# EAGLE design TI Bluetooth (EAGLE 9.6.2)
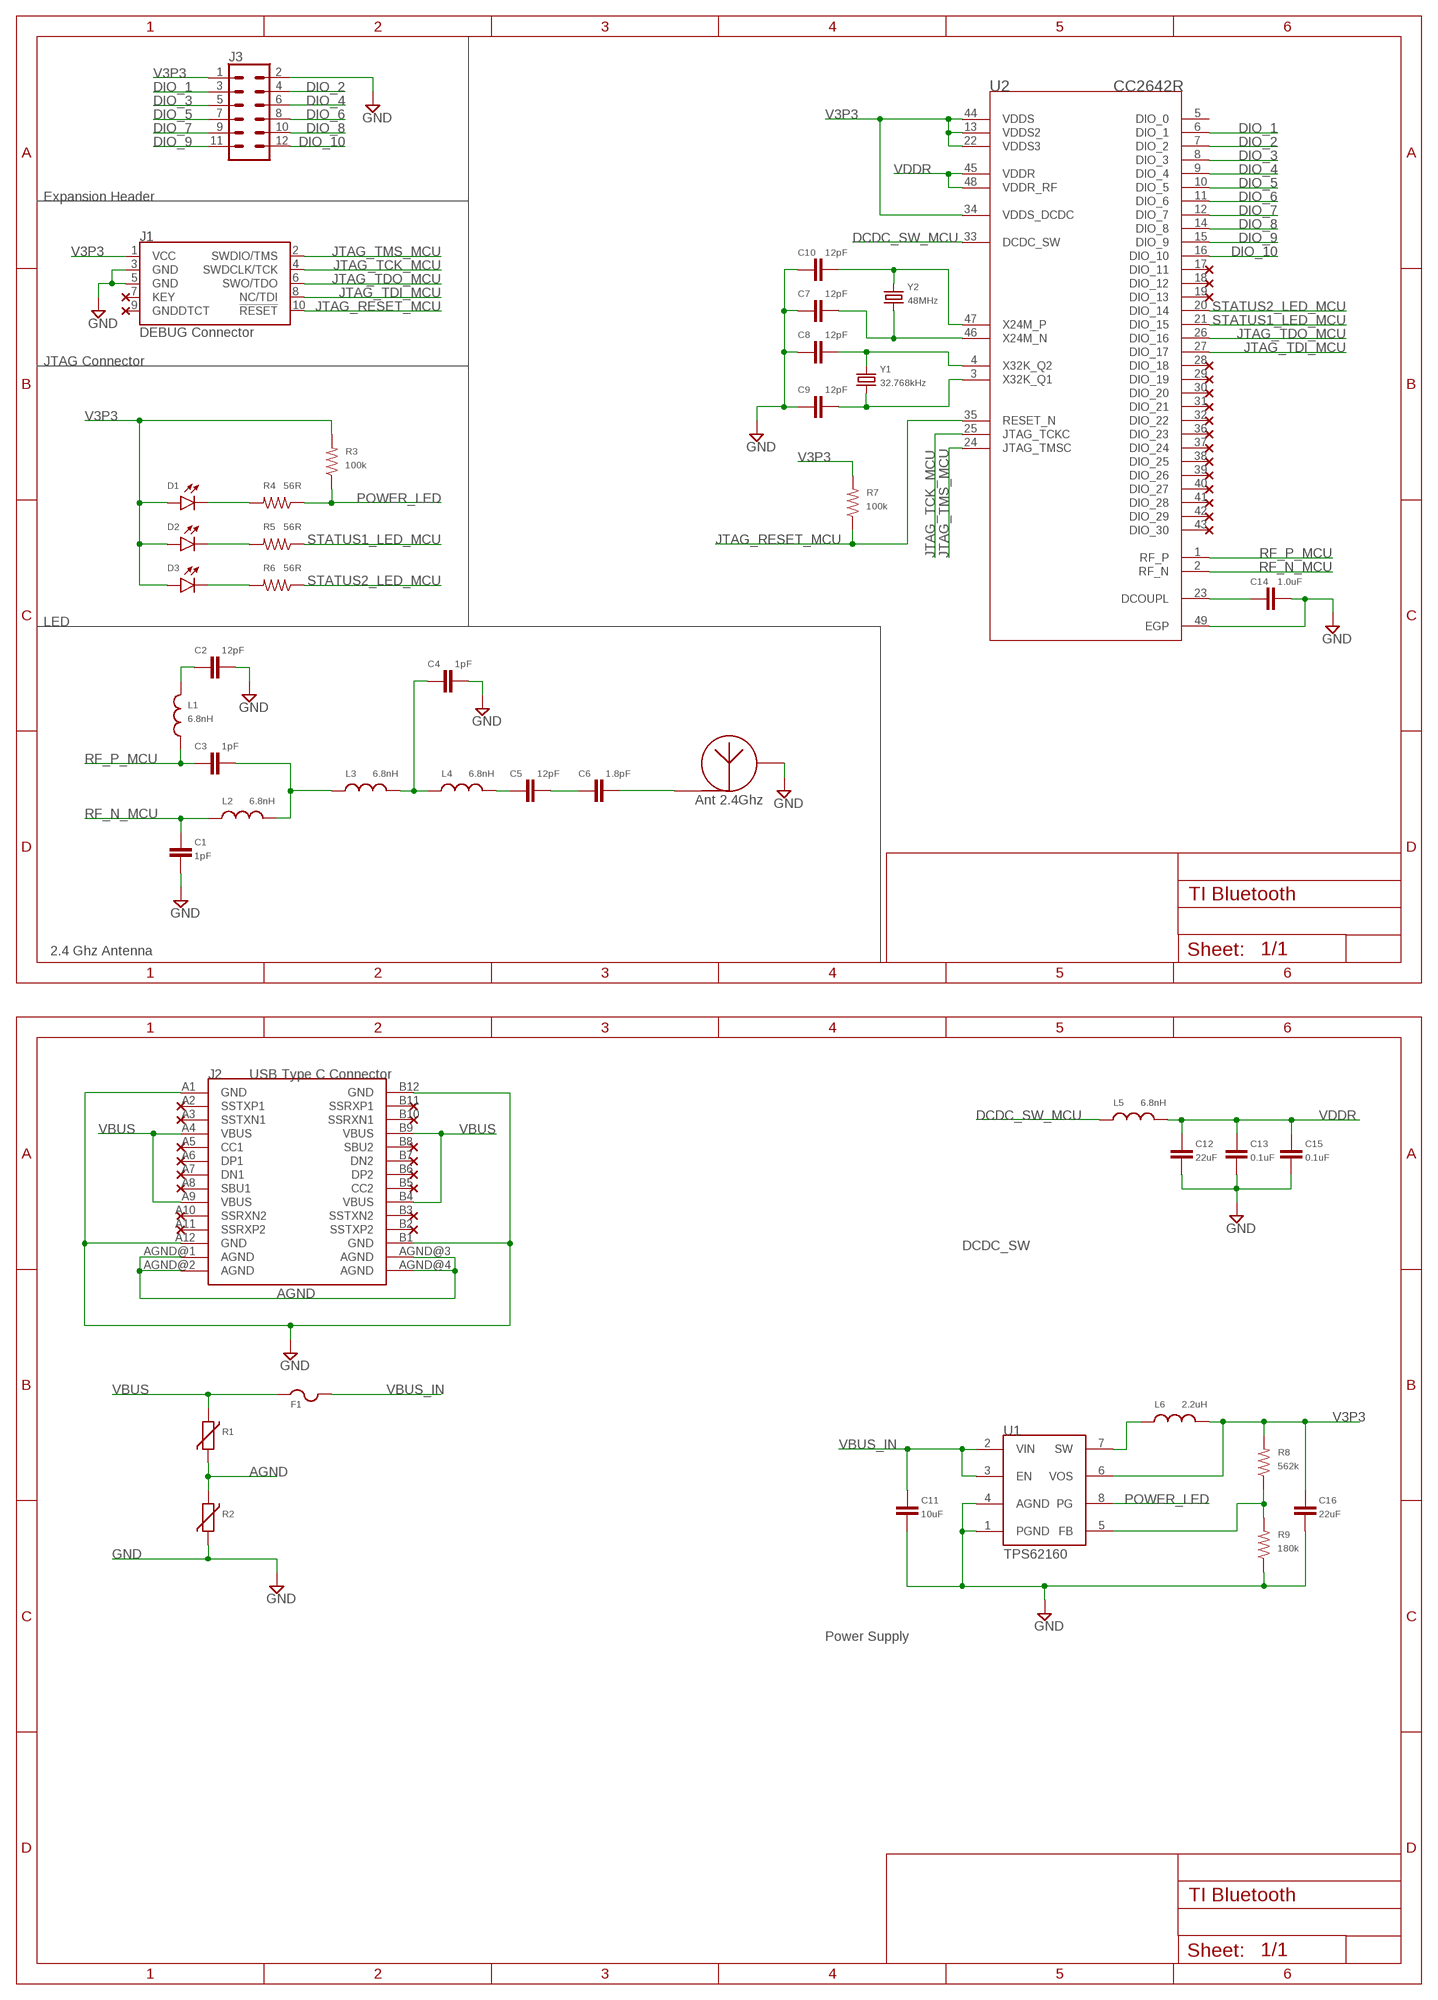
[diagram p0: schematic, sheet 1]

## Parts
ANT1  TI_AN043  [TI_AN043]
C1  1pF  C-EUC0603  [C0603]
C2  12pF  C-EUC0603  [C0603]
C3  1pF  C-EUC0603  [C0603]
C4  1pF  C-EUC0603  [C0603]
C5  12pF  C-EUC0603  [C0603]
C6  1.8pF  C-EUC0603  [C0603]
C7  12pF  C-EUC0603  [C0603]
C8  12pF  C-EUC0603  [C0603]
C9  12pF  C-EUC0603  [C0603]
C10  12pF  C-EUC0603  [C0603]
C11  10uF  C-EUC0603  [C0603]
C12  22uF  C-EUC0603  [C0603]
C13  0.1uF  C-EUC0603  [C0603]
C14  1.0uF  C-EUC0603  [C0603]
C15  0.1uF  C-EUC0603  [C0603]
C16  22uF  C-EUC0603  [C0603]
D1  POWER  LED1206  [LED-1206]
D2  STATUS1  LED1206  [LED-1206]
D3  STATUS2  LED1206  [LED-1206]
F1  1206L110THYR  PTCFUSE-1206  [R1206]
J1  DEBUG Connector  CORTEX_DEBUG_SMD  [SAMTECH_FTSH-105-01]
J2  USB Type C Connector  USB-C31-S-RA-CS1-BK-TR  [USB-C31-S-RA-CS1-BK-TR]
J3  Expansion Header  CONN_06X2PTH_FEMALE  [2X6]
L1  6.8nH  L_CHIP-0603(1608-METRIC)  [INDC1608X95N]
L2  6.8nH  L_CHIP-0603(1608-METRIC)  [INDC1608X95N]
L3  6.8nH  L_CHIP-0603(1608-METRIC)  [INDC1608X95N]
L4  6.8nH  L_CHIP-0603(1608-METRIC)  [INDC1608X95N]
L5  6.8nH  L_CHIP-0603(1608-METRIC)  [INDC1608X95N]
L6  2.2uH  L_CHIP-0603(1608-METRIC)  [INDC1608X95N]
R1  V5.5MLA  VARISTORCN0603  [CT/CN0603]
R2  V5.5MLA  VARISTORCN0603  [CT/CN0603]
R3  100k  R-US_R0603  [R0603]
R4  56R  R-US_R0603  [R0603]
R5  56R  R-US_R0603  [R0603]
R6  56R  R-US_R0603  [R0603]
R7  100k  R-US_R0603  [R0603]
R8  562k  R-US_R0603  [R0603]
R9  180k  R-US_R0603  [R0603]
U1  TPS62160  TPS62160VSSOP  [SOP65P490X110-8N]
U2  CC2642R  CC2642R1FRGZRRGZ0048A  [QFN50P700X690X100-49T515N]
Y1  32.768kHz  CRYSTAL-32.768KHZPTH-2X6  [CRYSTAL-PTH-2X6-CYL]
Y2  48MHz  CRYSTALSMD-5X3.2-2PAD  [CRYSTAL-SMD-5X3.2-2PAD]

## Nets
AGND: J2.AGND@1(AGND) J2.AGND@2(AGND) J2.AGND@3(AGND) J2.AGND@4(AGND) R1.2 R2.1
DCDC_SW_MCU: L5.1 U2.33(DCDC_SW)
DIO_1: J3.3 U2.6(DIO_1)
DIO_2: J3.4 U2.7(DIO_2)
DIO_3: J3.5 U2.8(DIO_3)
DIO_4: J3.6 U2.9(DIO_4)
DIO_5: J3.7 U2.10(DIO_5)
DIO_6: J3.8 U2.11(DIO_6)
DIO_7: J3.9 U2.12(DIO_7)
DIO_8: J3.10 U2.14(DIO_8)
DIO_9: J3.11 U2.15(DIO_9)
DIO_10: J3.12 U2.16(DIO_10)
GND: ANT1.FEED ANT1.RETURN C1.2 C2.2 C4.2 C6.2 C7.1 C8.1 C9.1 C10.2 C11.2 C12.2 C13.2 C14.2 C15.2 C16.2 J1.3(GND) J1.5(GND) J2.A1(GND) J2.A12(GND) J2.B1(GND) J2.B12(GND) J3.2 R2.2 R9.1 U1.1(PGND) U1.4(AGND) U2.49(EGP)
JTAG_RESET_MCU: J1.10(!RESET) R7.1 U2.35(RESET_N)
JTAG_TCK_MCU: J1.4(SWDCLK/TCK) U2.25(JTAG_TCKC)
JTAG_TDI_MCU: J1.8(NC/TDI) U2.27(DIO_17)
JTAG_TDO_MCU: J1.6(SWO/TDO) U2.26(DIO_16)
JTAG_TMS_MCU: J1.2(SWDIO/TMS) U2.24(JTAG_TMSC)
N$1: C8.2 U2.4(X32K_Q2) Y1.1
N$2: C9.2 U2.3(X32K_Q1) Y1.2
N$3: C10.1 U2.47(X24M_P) Y2.P$2
N$5: C14.1 U2.23(DCOUPL)
N$6: C2.1 L1.2
N$7: C7.2 U2.46(X24M_N) Y2.P$1
N$10: L6.1 U1.7(SW)
N$12: C4.1 L3.2 L4.1
N$13: C3.2 L2.2 L3.1
N$14: C5.1 L4.2
N$16: R8.1 R9.2 U1.5(FB)
N$17: C5.2 C6.1
N$18: D1.C R4.2
N$19: D3.C R6.2
N$20: D2.C R5.2
POWER_LED: R3.1 R4.1 U1.8(PG)
RF_N_MCU: C1.1 L2.1 U2.2(RF_N)
RF_P_MCU: C3.1 L1.1 U2.1(RF_P)
STATUS1_LED_MCU: R5.1 U2.21(DIO_15)
STATUS2_LED_MCU: R6.1 U2.20(DIO_14)
V3P3: C16.1 D1.A D2.A D3.A J1.1(VCC) J3.1 L6.2 R3.2 R7.2 R8.2 U1.6(VOS) U2.13(VDDS2) U2.22(VDDS3) U2.34(VDDS_DCDC) U2.44(VDDS)
VBUS: F1.1 J2.A4(VBUS) J2.A9(VBUS) J2.B4(VBUS) J2.B9(VBUS) R1.1
VBUS_IN: C11.1 F1.2 U1.2(VIN) U1.3(EN)
VDDR: C12.1 C13.1 C15.1 L5.2 U2.45(VDDR) U2.48(VDDR_RF)
Unconnected: J1.7(KEY) J1.9(GNDDTCT) J2.A2(SSTXP1) J2.A3(SSTXN1) J2.A5(CC1) J2.A6(DP1) J2.A7(DN1) J2.A8(SBU1) J2.A10(SSRXN2) J2.A11(SSRXP2) J2.B2(SSTXP2) J2.B3(SSTXN2) J2.B5(CC2) J2.B6(DP2) J2.B7(DN2) J2.B8(SBU2) J2.B10(SSRXN1) J2.B11(SSRXP1) U2.5(DIO_0) U2.17(DIO_11) U2.18(DIO_12) U2.19(DIO_13) U2.28(DIO_18) U2.29(DIO_19) U2.30(DIO_20) U2.31(DIO_21) U2.32(DIO_22) U2.36(DIO_23) U2.37(DIO_24) U2.38(DIO_25) U2.39(DIO_26) U2.40(DIO_27) U2.41(DIO_28) U2.42(DIO_29) U2.43(DIO_30)

## Notes on the sheet
- Expansion Header
- JTAG Connector
- LED
- 2.4 Ghz Antenna
- DCDC_SW
- Power Supply

## Library data of the parts
ANT1 = MyLibrary:TI_AN043: TI Antenna AN043 2.4GHz
C1-C16 = resistor:C-EU: CAPACITOR, European symbol
D1-D3 = SparkFun-LED:LED: LED (Generic) Standard schematic elements and footprints for 5mm, 3mm, 1206, and 0603 sized LEDs. Generic LEDs with no color specified.; PN: EAST1608GA6
F1 = adafruit:PTCFUSE: PTC fuses, resettable thermistors; PN: 1206L110THYR
J1 = SparkFun-Connectors:CORTEX_DEBUG: Cortex Debug Connector - 10 pin Supports JTAG debug, Serial Wire debug, and Serial Wire Viewer. PTH and SMD connector options available. General Connector Information <http://infocenter.arm.com/help/topic/com.arm.doc.faqs/attached/13634/cortex_debug_connectors.pdf> Products: PTH Connector <http://www.digikey.com/product-detail/en/cnc-tech/3220-10-0100-00/1175-1627-ND/3883661> -via Digi-Key SparkFun PSoc <https://www.sparkfun.com/products/13229> SparkFun T <https://www.sparkfun.com/products/13810>
J2 = MyLibrary:USB-C31-S-RA-CS1-BK-TR
J3 = SparkFun-Connectors:CONN_06X2: Multi connection point. Often used as Generic Header-pin footprint for 0.1 inch spaced/style header connections On any of the 0.1 inch spaced packages, you can populate with these: Break Away Headers - Straight <https://www.sparkfun.com/products/116> (PRT-00116) Break Away Male Headers - Right Angle <https://www.sparkfun.com/products/553> (PRT-00553) Female Headers <https://www.sparkfun.com/products/115> (PRT-00115) Break Away Headers - Machine Pin <https://www.sparkfun.com/products/117> (PRT-00117) Break Away Female Headers - Swiss Machine Pin <https://www.sparkfun.com/products/743> (PRT-00743); PROD_ID: CONN-12423; VALUE: 2X6 FEMALE
L1-L6 = Inductor:L: Inductor Fixed - Generic; CATEGORY: Inductor; SUB-CATEGORY: Fixed
R1 R2 = varistor:VARISTOR: VARISTOR; PN: V5.5MLA0603
R3-R9 = resistor:R-US_: RESISTOR, American symbol
U1 = MyLibrary:TPS62160; PN: TPS62160DGKR
U2 = MyLibrary:CC2642R1FRGZR: TI CC2642R MCU
Y1 = SparkFun-Clocks:CRYSTAL-32.768KHZ: 32.768kHz Crystal Frequency: 32.768kHz Frequency Stability: ±20ppm Load Capacitance: 12.5pF (PTH-2X6 & SMD-3.2X1.5), 6pF (SMD-2X6) SparkFun Products: SparkFun BigTime Watch Kit <https://www.sparkfun.com/products/11734> SparkFun nRF52832 Breakout <https://www.sparkfun.com/products/13990> SparkFun Real Time Clock Module <https://www.sparkfun.com/products/12708>; PN: AB26T; PROD_ID: XTAL-10112
Y2 = SparkFun-Clocks:CRYSTAL: Crystals (Generic) These are passive quartz crystals, which can be used as a clock source for a microcontroller. Crystal's are two-terminal devices. They require external "load" capacitors to generate an oscillating signal.

## Board
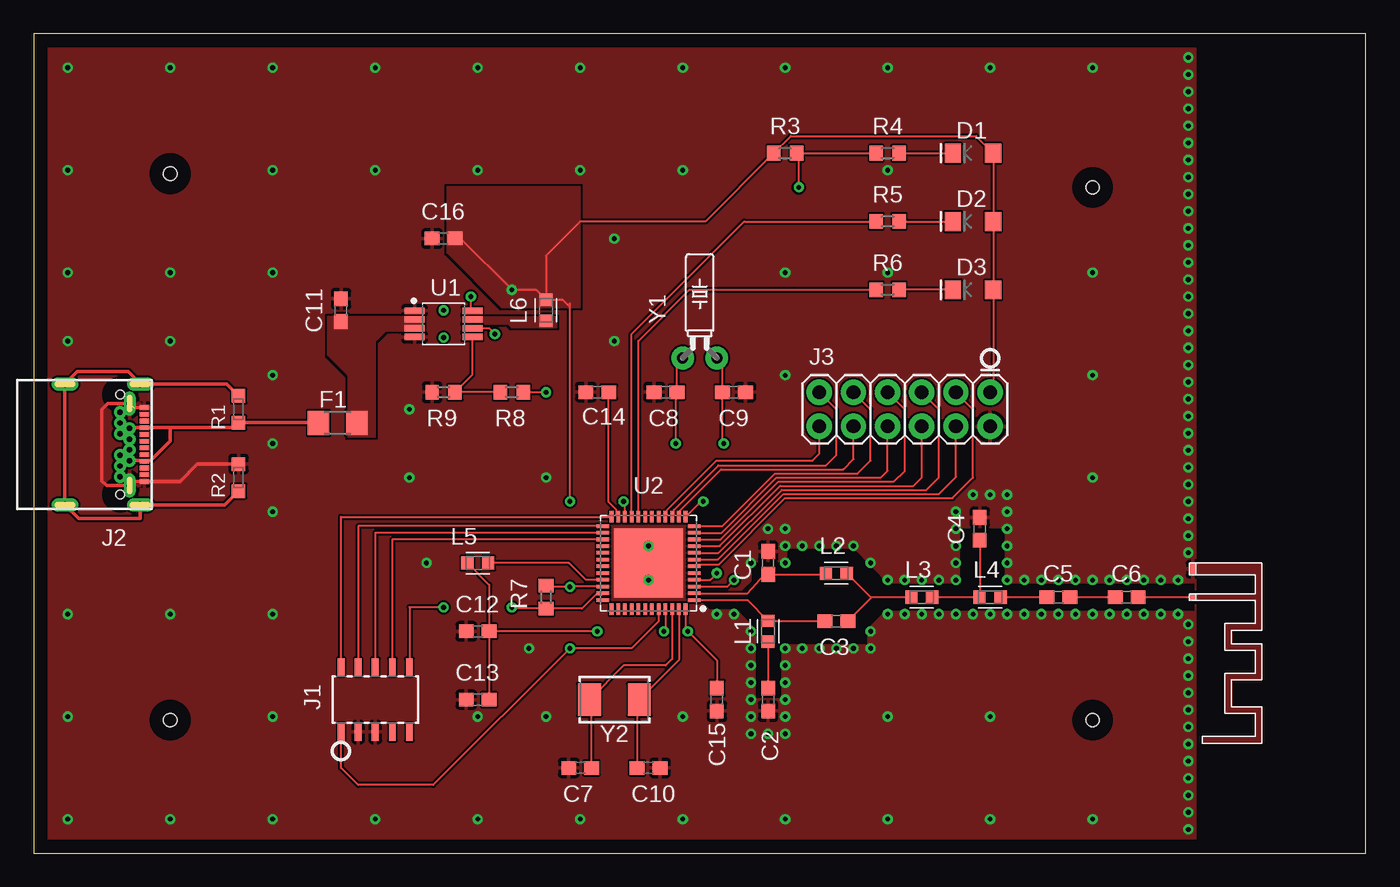
[diagram p1: board, top side]
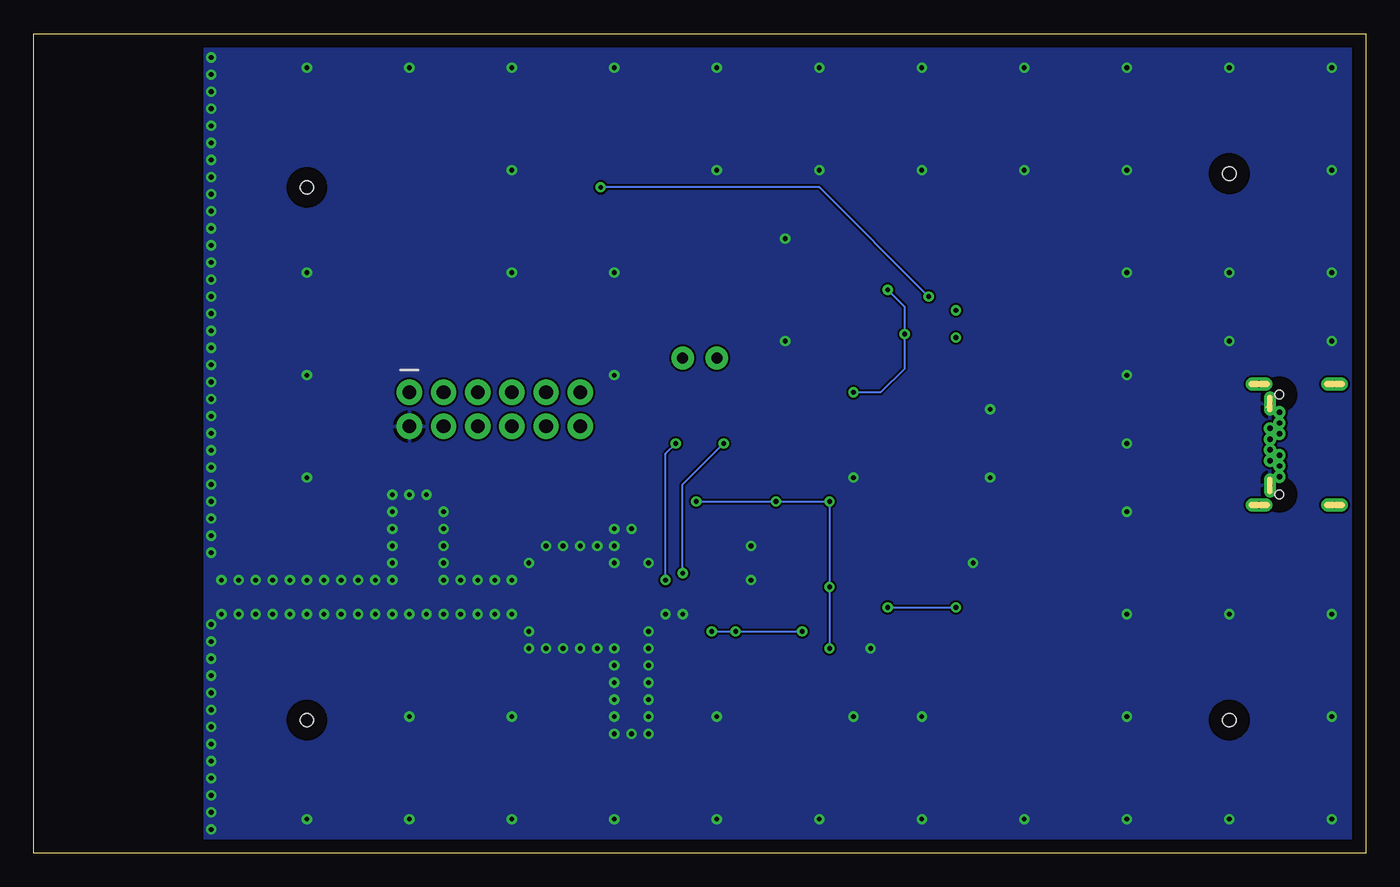
[diagram p2: board, bottom side, seen from below]

Size 99.06 x 60.96 mm. Coordinates in mm from the lower left corner, seen from the top.
Outline: 0,0 99.06,0 99.06,60.96 0,60.96 0,0
Copper layers (1*16): Top 0.035mm / dielectric 1.5mm / Bottom 0.035mm
Design rules "default": minimum track width 6mil, minimum drill 0.35mm, track to track 6mil, track to pad 6mil, pad to pad 6mil, via to via 6mil, smd to smd 6mil, copper to edge 40mil, drill to drill 6mil, minimum pad ring 10mil, minimum via ring 8mil, stop-mask expansion 4mil, vias tented up to drill 0mil, thermal gap 10mil
Holes 1 mm at 10.16,50.55 10.16,9.91 78.74,9.91 78.74,49.53

### Footprints (pad centres in the part's own frame; a part is rotated, then mirrored left to right if it is on the bottom)
TI_AN043 = smd 0.5 x 0.5: FEED 2.55,-0.25 | smd 0.9 x 0.5: RETURN 0.45,-0.25
C0603 = smd 1.1 x 1: 1 -0.85,0; 2 0.85,0
LED-1206 = smd 1.2 x 1.4: A -1.5,0; C 1.5,0
R1206 = smd 1.6 x 1.803: 1 -1.422,0; 2 1.422,0
SAMTECH_FTSH-105-01 = smd 0.508 x 1.27: 1 -2.54,-2.413; 2 -2.54,2.413; 3 -1.27,-2.413; 4 -1.27,2.413; 5 0,-2.413; 6 0,2.413; 7 1.27,-2.413; 8 1.27,2.413; 9 2.54,-2.413; 10 2.54,2.413
USB-C31-S-RA-CS1-BK-TR = smd 0.35 x 0.7: A1 7.75,0.65; A2 7.25,0.65; A3 6.75,0.65; A4 6.25,0.65; A5 5.75,0.65; A6 5.25,0.65; A7 4.75,0.65; A8 4.25,0.65; A9 3.75,0.65; A10 3.25,0.65; A11 2.75,0.65; A12 2.25,0.65 | drill 0.5 pad 1 long: AGND@1 9.5,0.96; AGND@2 9.5,6.56; AGND@3 0.5,0.96; AGND@4 0.5,6.56 | drill 0.4 pad 0.7 long: B1 1.95,1.76; B12 8.05,1.76 | drill 0.4 pad 0.61: B2 2.6,2.46; B3 3.4,2.46; B4 3.8,1.76; B5 4.2,2.46; B6 4.6,1.76; B7 5.4,1.76; B8 5.8,2.46; B9 6.2,1.76; B10 6.6,2.46; B11 7.4,2.46 | hole 0.65: 8.725,2.46; 1.275,2.46
2X6 = drill 1.016 pad 1.88: 1 0,0; 2 0,2.54; 3 2.54,0; 4 2.54,2.54; 5 5.08,0; 6 5.08,2.54; 7 7.62,0; 8 7.62,2.54; 9 10.16,0; 10 10.16,2.54; 11 12.7,0; 12 12.7,2.54
INDC1608X95N = smd 0.9 x 0.97: 1 -0.785,0 | smd 0.933 x 0.97: 2 0.769,0
CT/CN0603 = smd 1 x 1: 1 -1,0; 2 1,0
R0603 = smd 1 x 1.1: 1 -0.85,0; 2 0.85,0
SOP65P490X110-8N = smd 1.471 x 0.481: 1 -2.15,0.975; 2 -2.15,0.325; 3 -2.15,-0.325; 4 -2.15,-0.975; 5 2.15,-0.975; 6 2.15,-0.325; 7 2.15,0.325; 8 2.15,0.975
QFN50P700X690X100-49T515N = smd 0.936 x 0.264: 1 -3.389,2.75; 2 -3.389,2.25; 3 -3.389,1.75; 4 -3.389,1.25; 5 -3.389,0.75; 6 -3.389,0.25; 7 -3.389,-0.25; 8 -3.389,-0.75; 9 -3.389,-1.25; 10 -3.389,-1.75; 11 -3.389,-2.25; 12 -3.389,-2.75; 25 3.389,-2.75; 26 3.389,-2.25; 27 3.389,-1.75; 28 3.389,-1.25; 29 3.389,-0.75; 30 3.389,-0.25; 31 3.389,0.25; 32 3.389,0.75; 33 3.389,1.25; 34 3.389,1.75; 35 3.389,2.25; 36 3.389,2.75 | smd 0.264 x 0.86: 13 -2.75,-3.435; 14 -2.25,-3.435; 15 -1.75,-3.435; 16 -1.25,-3.435; 17 -0.75,-3.435; 18 -0.25,-3.435; 19 0.25,-3.435; 20 0.75,-3.435; 21 1.25,-3.435; 22 1.75,-3.435; 23 2.25,-3.435; 24 2.75,-3.435; 37 2.75,3.435; 38 2.25,3.435; 39 1.75,3.435; 40 1.25,3.435; 41 0.75,3.435; 42 0.25,3.435; 43 -0.25,3.435; 44 -0.75,3.435; 45 -1.25,3.435; 46 -1.75,3.435; 47 -2.25,3.435; 48 -2.75,3.435 | smd 5.15 x 5.15: 49 0,0
CRYSTAL-PTH-2X6-CYL = drill 0.813 pad 1.676: 1 -1.27,0; 2 1.27,0
CRYSTAL-SMD-5X3.2-2PAD = smd 1.7 x 2.4: P$1 1.85,0; P$2 -1.85,0

### Placement (x,y rotation side)
ANT1  86.43,21.59 270 top
C1  54.61,21.59 90 top
C2  54.61,11.43 270 top
C3  59.69,17.27 0 top
C4  70.36,24.13 90 top
C5  76.2,19.05 0 top
C6  81.28,19.05 0 top
C7  40.64,6.35 0 top
C8  46.99,34.29 0 top
C9  52.07,34.29 180 top
C10  45.72,6.35 0 top
C11  22.86,40.39 90 top
C12  33.02,16.51 180 top
C13  33.02,11.43 180 top
C14  41.91,34.29 180 top
C15  50.8,11.43 270 top
C16  30.48,45.72 180 top
D1  69.85,52.07 180 top
D2  69.85,46.99 180 top
D3  69.85,41.91 180 top
F1  22.61,32 0 top
J1  25.4,11.43 0 top
J2  8.89,25.4 90 top
J3  71.12,34.29 180 top
L1  54.61,16.51 270 top
L2  59.69,20.83 0 top
L3  66.04,19.05 0 top
L4  71.12,19.05 0 top
L5  33.02,21.59 180 top
L6  38.1,40.39 90 top
R1  15.24,33.02 90 top
R2  15.24,27.94 90 top
R3  55.88,52.07 180 top
R4  63.5,52.07 0 top
R5  63.5,46.99 0 top
R6  63.5,41.91 0 top
R7  38.1,19.05 90 top
R8  35.56,34.29 0 top
R9  30.48,34.29 0 top
U1  30.48,39.37 0 top
U2  45.72,21.59 180 top
Y1  49.53,36.83 0 top
Y2  43.18,11.43 180 top

### Tracks (layer width: path | path; a pad name or v marks a point on that pad's centre or on a via)
AGND
  Top 0.254: R2.1 14.2,25.9 J2.AGND@3 7.93,24.89 3.34,24.89 J2.AGND@4 J2.AGND@2 3.24,35.81 7.02,35.81 J2.AGND@1 14.36,34.9 R1.2
DCDC_SW_MCU
  Top 0.152: U2.33 41.06,20.34 39.81,21.59 L5.1
DIO_1
  Top 0.152: U2.6 49.25,21.48 50.94,21.48 55.88,26.42 68.33,26.42 69.85,27.94 69.85,33.02 J3.3
DIO_2
  Top 0.152: U2.7 50.87,21.84 55.75,26.72 67.31,26.72 68.58,27.99 J3.4
DIO_3
  Top 0.152: U2.8 50.94,22.34 55.63,27.03 66.4,27.03 67.31,27.94 67.31,33.02 J3.5
DIO_4
  Top 0.152: U2.9 51.01,22.84 55.5,27.33 65.43,27.33 66.04,27.94 J3.6
DIO_5
  Top 0.152: U2.10 51.08,23.34 55.37,27.64 63.96,27.64 64.77,28.45 64.77,33.02 J3.7
DIO_6
  Top 0.152: U2.11 51.15,23.84 55.25,27.94 62.99,27.94 63.5,28.45 J3.8
DIO_7
  Top 0.152: U2.12 51.22,24.34 55.12,28.25 61.27,28.25 62.23,29.21 62.23,33.02 J3.9
DIO_8
  Top 0.152: U2.14 48.11,25.16 48.11,25.55 51.11,28.55 60.2,28.55 60.96,29.31 J3.10
DIO_9
  Top 0.152: U2.15 47.61,25.16 47.61,25.55 50.91,28.85 58.93,28.85 59.69,29.62 59.69,33.02 J3.11
DIO_10
  Top 0.152: U2.16 47.11,25.16 47.11,25.55 50.77,29.21 57.91,29.21 58.42,29.72 J3.12
FEED
  cutout Top: 48.7,19.4 52.65,19.4 53.5,20.25 53.5,21.59 56.13,21.59 56.13,22.61 60.96,22.61 63.5,20 69,20 69,24.13 72.1,24.13 72.1,20 86.24,20 86.24,18.1 63.3,18.1 61.9,16.7 61.9,15.6 55.5,15.6 55.5,11.59 53.8,11.59 53.8,16.7 52.3,18.2 50.3,18.2 49.75,18.75 48.75,18.75 48.7,18.8
GND  (via drill 0.35)  (1 unrouted)
  Top 0.152: ANT1.RETURN 86.05,21.08 | C6.2 86.1,19.05 ANT1.FEED
  Top 0.254: R2.2 12.18,28.94 10.89,27.65 J2.A12 7.53,27.65 7.48,27.7 | J2.A1 7.53,33.15 7.48,33.1 | J2.B12 5.51,33.45 5.08,33.02 5.08,27.69 5.42,27.35 J2.B1
  other vias: 85.85,17.02 85.85,15.75 85.85,14.48 85.85,13.21 85.85,11.94 85.85,10.67 85.85,9.4 85.85,8.13 85.85,6.86 85.85,5.59 85.85,4.32 85.85,3.05 85.85,1.78 85.85,22.35 85.85,23.62 85.85,24.89 85.85,26.16 85.85,27.43 85.85,28.7 85.85,29.97 85.85,31.24 85.85,32.51 85.85,33.78 85.85,35.05 85.85,36.32 85.85,37.59 85.85,38.86 85.85,40.13 85.85,41.4 85.85,42.67 85.85,43.94 85.85,45.21 85.85,46.48 85.85,47.75 85.85,49.02 85.85,50.29 85.85,51.56 85.85,52.83 85.85,54.1 85.85,55.37 85.85,56.64 85.85,57.91 85.09,17.78 83.82,17.78 82.55,17.78 81.28,17.78 80.01,17.78 78.74,17.78 77.47,17.78 76.2,17.78 74.93,17.78 73.66,17.78 72.39,17.78 69.85,17.78 71.12,17.78 68.58,17.78 67.31,17.78 64.77,17.78 66.04,17.78 63.5,17.78 62.23,16.51 62.23,15.24 60.96,15.24 59.69,15.24 58.42,15.24 57.15,15.24 55.88,15.24 55.88,13.97 55.88,12.7 55.88,11.43 55.88,10.16 55.88,8.89 54.61,8.89 53.34,8.89 53.34,10.16 53.34,11.43 53.34,12.7 53.34,13.97 53.34,15.24 53.34,16.51 52.07,17.78 50.8,17.78 53.34,21.59 55.88,21.59 55.88,22.86 55.88,24.13 54.61,24.13 57.15,22.86 58.42,22.86 59.69,22.86 60.96,22.86 62.23,21.59 63.5,20.32 64.77,20.32 66.04,20.32 67.31,20.32 68.58,20.32 68.58,21.59 68.58,22.86 68.58,24.13 68.58,25.4 69.85,26.67 71.12,26.67 72.39,26.67 72.39,25.4 72.39,24.13 72.39,22.86 72.39,21.59 72.39,20.32 73.66,20.32 74.93,20.32 76.2,20.32 77.47,20.32 80.01,20.32 78.74,20.32 81.28,20.32 82.55,20.32 83.82,20.32 85.09,20.32 2.54,2.54 10.16,2.54 17.78,2.54 25.4,2.54 33.02,2.54 40.64,2.54 48.26,2.54 55.88,2.54 63.5,2.54 71.12,2.54 78.74,2.54 71.12,10.16 63.5,10.16 38.1,10.16 36.83,15.24 29.21,21.59 48.26,10.16 17.78,10.16 33.02,10.16 2.54,43.18 17.78,43.18 10.16,43.18 2.54,38.1 10.16,38.1 17.78,35.56 10.16,58.42 25.4,58.42 33.02,58.42 40.64,58.42 48.26,58.42 55.88,58.42 63.5,58.42 71.12,58.42 78.74,58.42 25.4,50.8 33.02,50.8 40.64,50.8 48.26,50.8 63.5,50.8 78.74,43.18 78.74,35.56 78.74,27.94 55.88,43.18 55.88,35.56 63.5,43.18 43.18,38.1 43.18,45.72 85.85,59.18 2.54,10.16 2.54,17.78 10.16,17.78 17.78,17.78 17.78,25.4 27.94,33.02 38.1,27.94 27.94,27.94 17.78,30.48 2.54,58.42 17.78,58.42 17.78,50.8 2.54,50.8 45.72,22.86 45.72,20.32
  pour Top (rank 6): 0,60.96 86.36,60.96 86.36,0 0,0
  pour Bottom (rank 6): 0,60.96 86.36,60.96 86.36,0 0,0
  pour Top (no thermals): 86.3,21.6 91.33,21.6 91.33,16.59 89.08,16.59 89.08,15.59 91.32,15.59 91.32,12.89 89.08,12.89 89.08,10.89 91.33,10.89 91.33,8.19 86.9,8.19 86.9,8.69 90.83,8.69 90.83,10.39 88.58,10.39 88.58,13.39 90.83,13.39 90.83,15.09 88.57,15.09 88.57,17.09 90.83,17.09 90.83,18.79 86.3,18.79 86.3,19.29 90.83,19.29 90.83,20.69 86.3,20.69
JTAG_RESET_MCU  (via drill 0.35)
  Top 0.152: U2.35 42.19,19.2 41.77,19.2 40.77,18.2 R7.1 35.65,18.2 v35.56,18.29 | v30.48,18.29 27.94,18.29 J1.10
  Bottom 0.152: v35.56,18.29 v30.48,18.29
JTAG_TCK_MCU
  Top 0.152: U2.25 24.13,24.34 J1.4
JTAG_TDI_MCU
  Top 0.152: J1.8 26.67,23.34 U2.27
JTAG_TDO_MCU
  Top 0.152: U2.26 25.4,23.84 J1.6
JTAG_TMS_MCU
  Top 0.152: U2.24 22.86,25.02 J1.2
N$1  (via drill 0.35)
  Top 0.152: U2.4 50.31,20.34 v50.8,20.83 | v47.75,30.48 47.75,34.2 C8.2 47.84,36.41 Y1.1
  Bottom 0.152: v50.8,20.83 50.8,27.43 v47.75,30.48
N$2  (via drill 0.35)
  Top 0.152: U2.3 51.59,19.84 v52.07,20.32 | v51.31,30.48 51.22,30.57 C9.2 51.22,36.41 Y1.2
  Bottom 0.152: v52.07,20.32 52.07,29.72 v51.31,30.48
N$3
  Top 0.152: C10.1 44.87,11.27 Y2.P$2 47.97,14.37 U2.47
N$4  (via drill 0.35)
  other vias: 30.48,40.39
N$5
  Top 0.152: U2.23 43.33,25.16 43.33,25.55 42.76,26.12 C14.1
N$6
  Top 0.152: L1.2 C2.1
N$7
  Top 0.152: C7.2 41.49,11.27 Y2.P$1 43.87,13.97 46.99,13.97 47.47,14.45 U2.46
N$8  (via drill 0.35)
  other vias: 30.48,38.35
N$10
  pour Top (no thermals): 32,39.88 38.86,39.88 38.86,39.12 35.56,39.12 35.31,39.37 32,39.37
N$12
  Top 0.152: C4.1 70.36,19.07 L4.1 L3.2
N$13
  Top 0.152: C3.2 62.32,19.05 | 62.32,19.05 L3.1 | L2.2 62.24,19.05 62.32,19.05
N$14
  Top 0.152: L4.2 C5.1
N$16
  Top 0.152: R8.1 R9.2 32.63,35.59 U1.5
N$17
  Top 0.152: C5.2 C6.1
N$18
  Top 0.152: R4.2 D1.C
N$19
  Top 0.152: D3.C R6.2
N$20
  Top 0.152: R5.2 D2.C
POWER_LED  (via drill 0.35)
  Top 0.152: U1.8 32.51,40.46 v32.51,41.4 | v56.9,49.53 56.9,51.9 R3.1 R4.1
  Bottom 0.152: v32.51,41.4 40.64,49.53 v56.9,49.53
RF_N_MCU
  Top 0.152: U2.2 53.09,19.34 54.36,20.74 C1.1 58.82,20.74 L2.1
RF_P_MCU
  Top 0.152: U2.1 53.09,18.84 L1.1 58.82,17.3 C3.1
STATUS1_LED_MCU
  Top 0.152: U2.21 44.47,38.63 52.83,46.99 R5.1
STATUS2_LED_MCU
  Top 0.152: U2.20 44.97,38.1 48.78,41.91 R6.1
V3P3  (via drill 0.35)
  Top 0.152: U2.13 49.61,26.16 v49.78,26.16 | J3.1 71.35,34.52 D3.A D2.A D1.A 70.08,53.34 56.3,53.34 R3.2 49.95,46.99 40.64,46.99 38.1,44.45 L6.2 | U2.44 46.47,17.26 44.45,15.24 v39.88,15.24 29.72,5.08 24.13,5.08 22.86,6.35 J1.1 | U2.22 43.97,26.16 v43.86,26.16 | R8.2 v38.1,34.29 | v39.88,26.16 39.88,40.64 | 39.88,40.64 39.88,40.89 | U2.34 39.88,19.84 | v39.88,19.81 38.1,19.81 R7.2 | L6.2 37.34,41.91 v35.56,41.91 31.75,45.72 C16.1 | 39.88,40.64 39.36,41.16 L6.2 | U1.6 33.85,39.05 v34.29,38.61
  Top 0.406: 39.88,19.84 v39.88,19.81
  Bottom 0.152: v39.88,15.24 v39.88,19.81 v39.88,26.16 v43.86,26.16 v49.78,26.16 | v35.56,41.91 34.29,40.64 v34.29,38.61 34.29,36.07 36.07,34.29 v38.1,34.29
  pour Top (no thermals): 30.73,49.53 30.73,44.7 34.8,40.64 40.64,40.64 40.64,49.53
VBUS
  Top 0.152: 21.17,32.02 F1.1 | R1.1 14.87,31.65
  Top 0.254: R1.1 21.17,32.02 | 14.87,31.65 10.16,31.65 | 10.16,31.65 J2.A4 7.18,31.65 J2.B9 | J2.A9 8.29,29.2 | 8.29,29.2 8.71,29.2 10.16,30.65 10.16,31.65 | J2.B4 7.77,29.2 8.29,29.2
VBUS_IN
  pour Top (no thermals): 28.96,39.88 21.84,39.88 21.84,37.08 23.37,35.56 23.37,30.99 25.4,30.99 25.4,38.1 26.16,38.86 28.96,38.86
VDDR  (via drill 0.35)
  Top 0.152: U2.48 48.47,16.81 v48.64,16.51 50.8,14.35 C15.1 | U2.45 46.97,16.62 v46.86,16.51 | L5.2 33.87,19.97 C12.1 | C12.1 C13.1 | v41.91,16.51 C12.1
  Bottom 0.152: v48.64,16.51 v46.86,16.51 v41.91,16.51